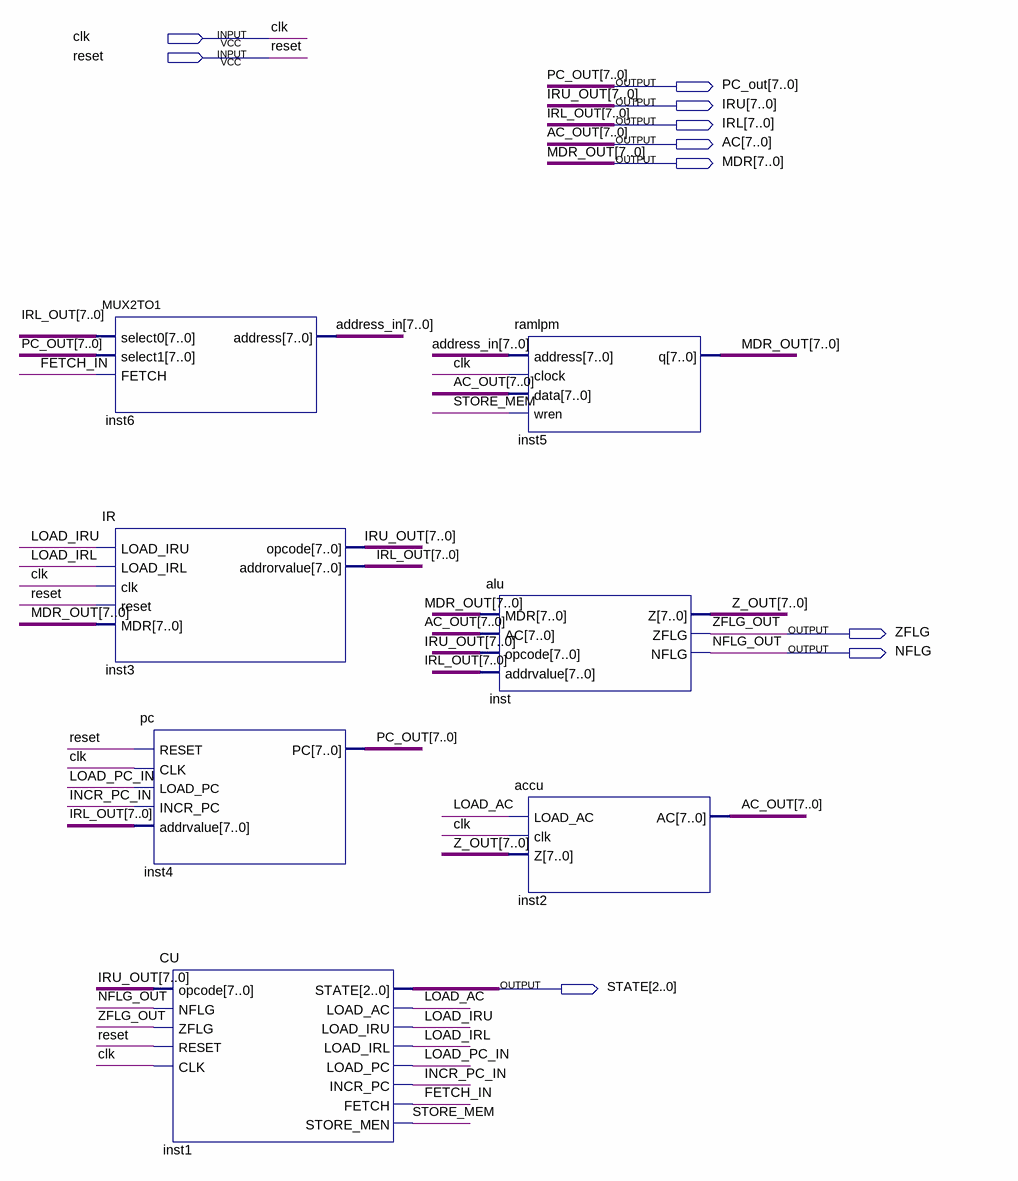
[diagram p0: schematic sheet]
// Quartus schematic MCU.bdf as structural Verilog: 7 symbols, 10 pins
module MCU (
  input  clk,
  input  reset,
  output [7:0] PC_out,
  output [7:0] IRU,
  output [7:0] IRL,
  output [7:0] AC,
  output [7:0] MDR,
  output ZFLG,
  output NFLG,
  output [2:0] STATE
);

  wire FETCH_IN, INCR_PC_IN, LOAD_AC, LOAD_IRL, LOAD_IRU, LOAD_PC_IN, STORE_MEM;
  wire [7:0] address_in, Z_OUT;

  MUX2TO1 inst6 (.select0(IRL), .select1(PC_out), .FETCH(FETCH_IN), .address(address_in));
  IR inst3 (
    .LOAD_IRU(LOAD_IRU), .LOAD_IRL(LOAD_IRL), .clk(clk), .reset(reset), .MDR(MDR), .opcode(IRU),
    .addrorvalue(IRL));
  pc inst4 (.RESET(reset), .CLK(clk), .LOAD_PC(LOAD_PC_IN), .INCR_PC(INCR_PC_IN), .addrvalue(IRL), .PC(PC_out));
  CU inst1 (
    .opcode(IRU), .NFLG(NFLG), .ZFLG(ZFLG), .RESET(reset), .CLK(clk), .STATE(STATE), .LOAD_AC(LOAD_AC),
    .LOAD_IRU(LOAD_IRU), .LOAD_IRL(LOAD_IRL), .LOAD_PC(LOAD_PC_IN), .INCR_PC(INCR_PC_IN), .FETCH(FETCH_IN),
    .STORE_MEN(STORE_MEM));
  ramlpm inst5 (.address(address_in), .clock(clk), .data(AC), .wren(STORE_MEM), .q(MDR));
  alu inst (.MDR(MDR), .AC(AC), .opcode(IRU), .addrvalue(IRL), .Z(Z_OUT), .ZFLG(ZFLG), .NFLG(NFLG));
  accu inst2 (.LOAD_AC(LOAD_AC), .clk(clk), .Z(Z_OUT), .AC(AC));

  // Other names for the same wires on the sheet: AC_OUT[7:0] = AC; IRL_OUT[7:0] = IRL; IRU_OUT[7:0] = IRU;
  //   MDR_OUT[7:0] = MDR; NFLG_OUT = NFLG; ZFLG_OUT = ZFLG
endmodule
